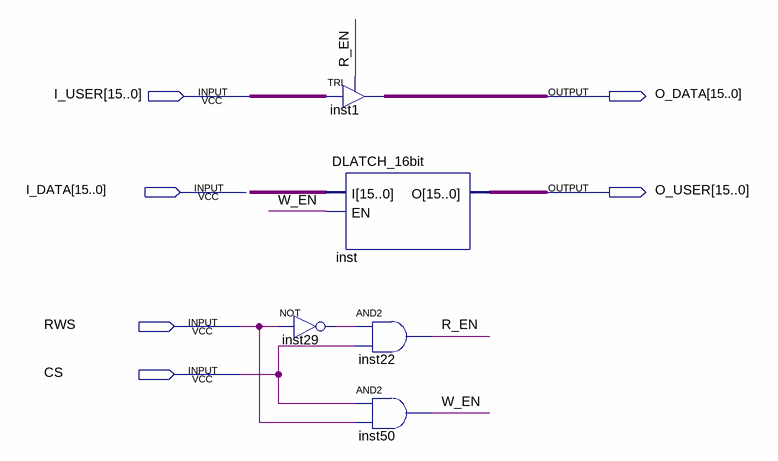
[diagram p0: schematic sheet]
// Quartus schematic IO_Controller.bdf as structural Verilog: 5 symbols, 6 pins
module IO_Controller (
  input  [15:0] I_USER,
  input  [15:0] I_DATA,
  input  RWS,
  input  CS,
  output [15:0] O_DATA,
  output [15:0] O_USER
);

  wire inst29_out, R_EN, W_EN;

  TRI inst1[15:0] (.IN(I_USER), .OE(R_EN), .OUT(O_DATA));
  DLATCH_16bit inst (.I(I_DATA), .EN(W_EN), .O(O_USER));
  not inst29 (inst29_out, RWS);
  and inst22 (R_EN, inst29_out, CS);
  and inst50 (W_EN, CS, RWS);
endmodule
